# EAGLE design Wrinkles (EAGLE 6.4)
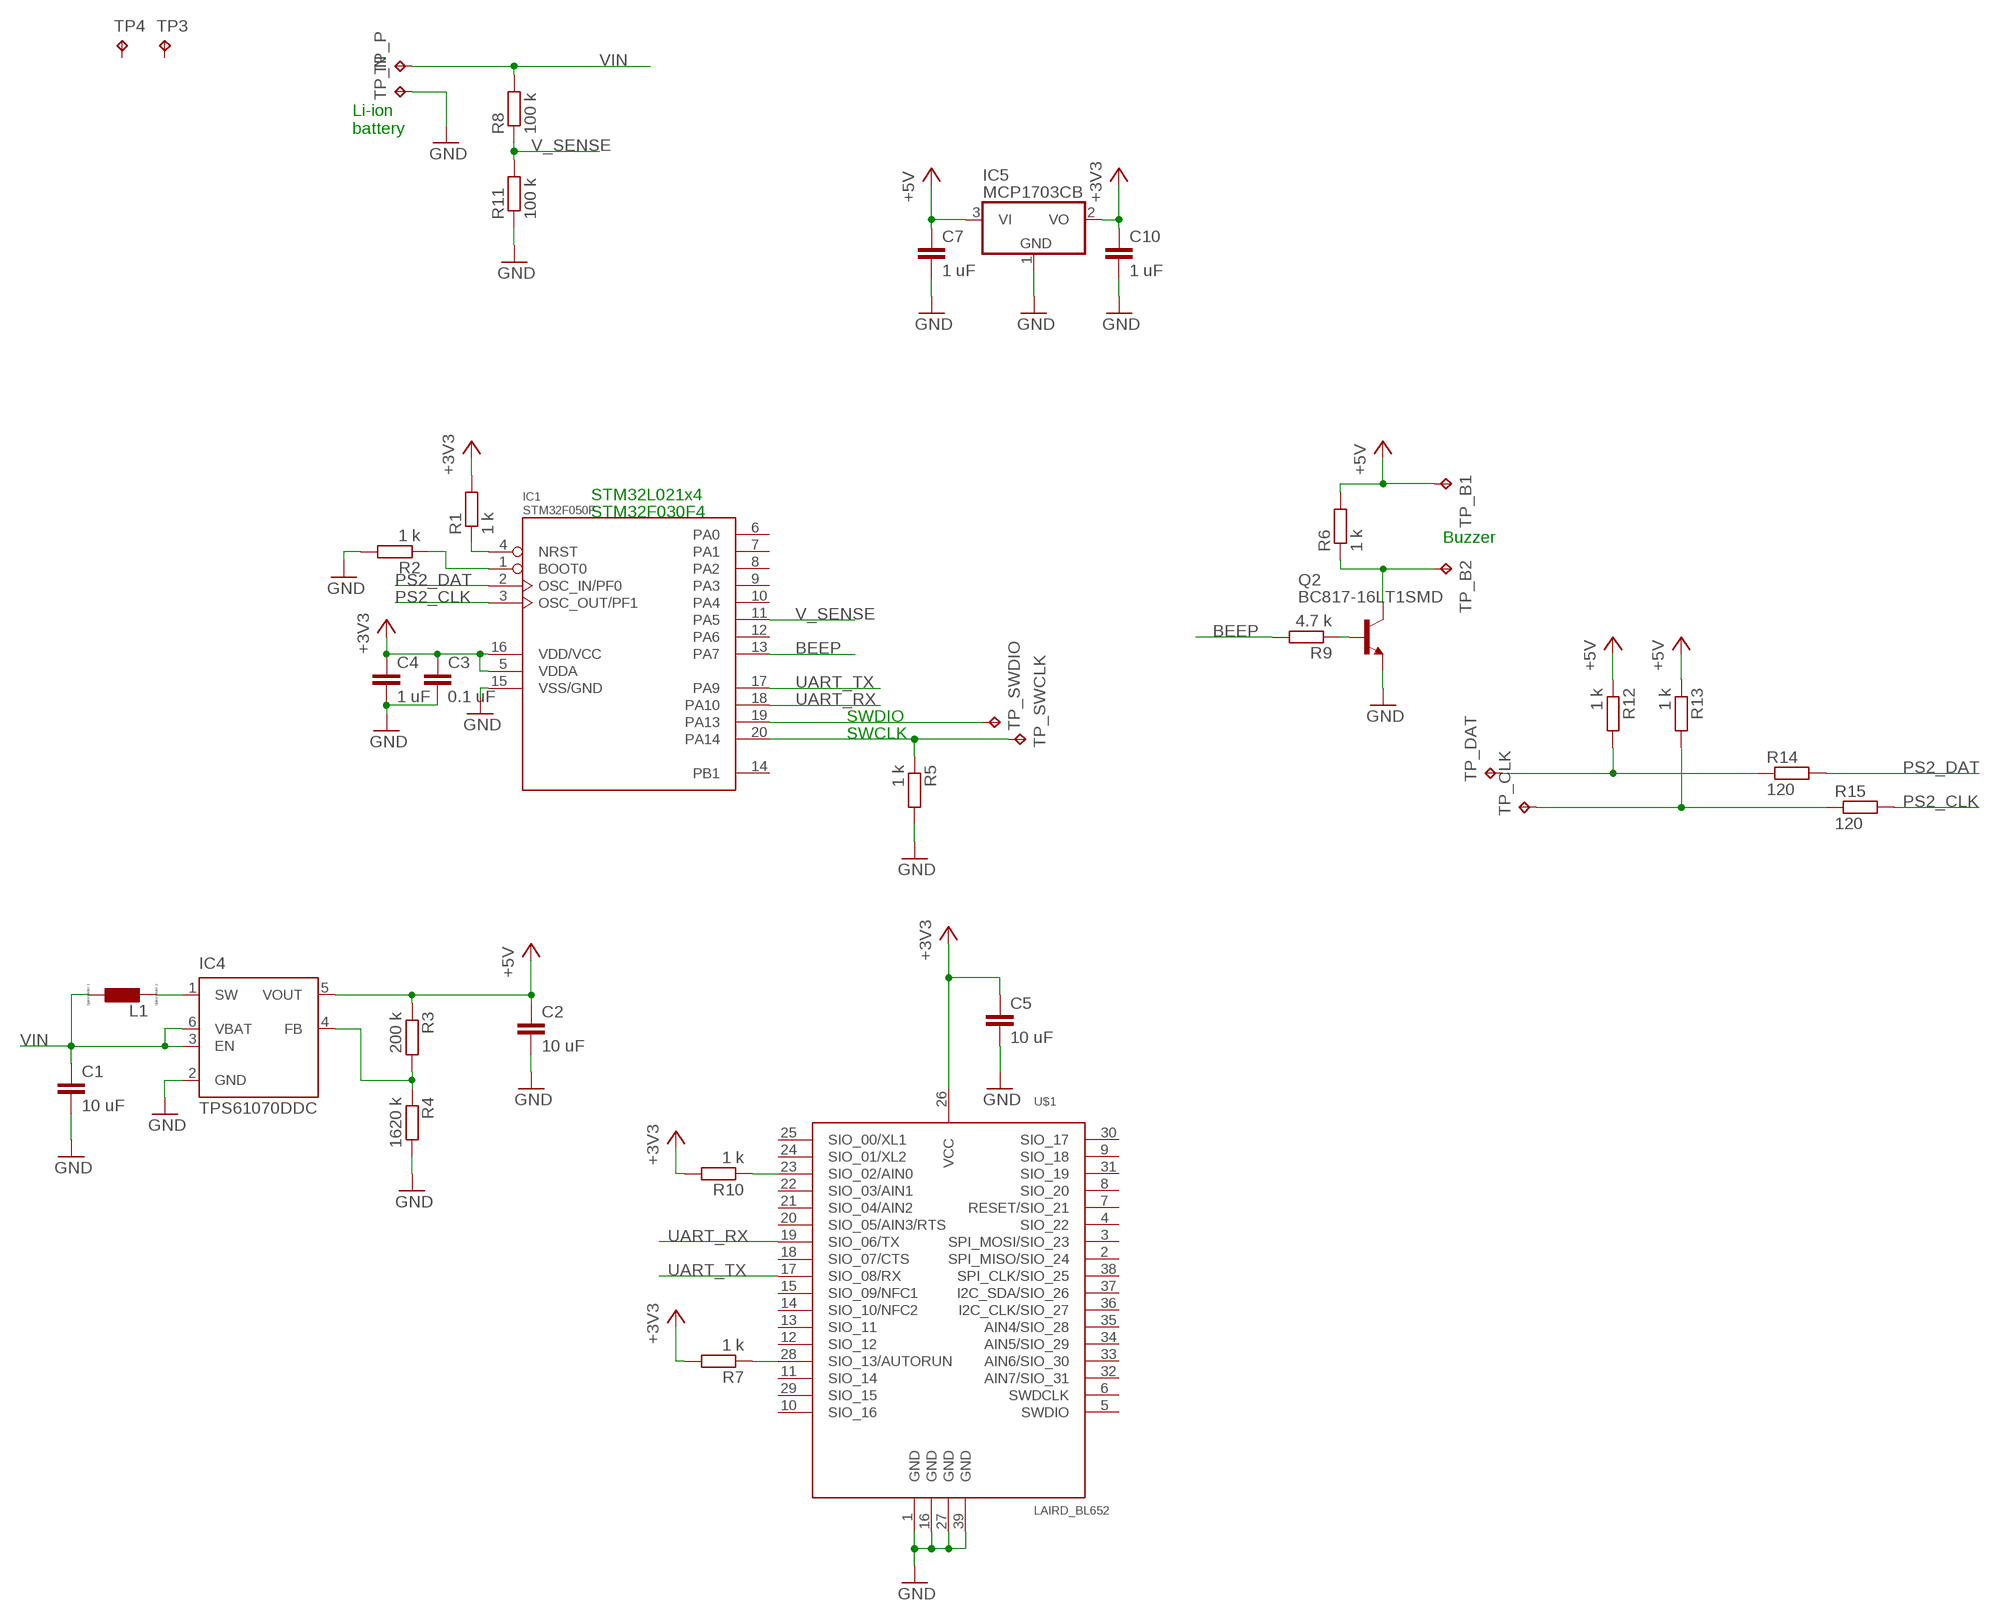
[diagram p0: schematic, sheet 1]

## Parts
C1  10 uF  C-EUC0603  [C0603]
C2  10 uF  C-EUC0603  [C0603]
C3  0.1 uF  C-EUC0402  [C0402]
C4  1 uF  C-EUC0402  [C0402]
C5  10 uF  C-EUC0603  [C0603]
C7  1 uF  C-EUC0402  [C0402]
C10  1 uF  C-EUC0402  [C0402]
IC1  STM32F050F  [TSSOP20]
IC4  TPS61070DDC  [TSOT23-6_DDC]
IC5  MCP1703CB  [SOT23]
L1  LL5038P  [L5038P]
Q2  BC817-16LT1SMD  [SOT23-BEC]
R1  1 k  R-EU_R0402  [R0402]
R2  1 k  R-EU_R0402  [R0402]
R3  200 k  R-EU_R0603  [R0603]
R4  1620 k  R-EU_R0603  [R0603]
R5  1 k  R-EU_R0402  [R0402]
R6  1 k  R-EU_R0402  [R0402]
R7  1 k  R-EU_R0402  [R0402]
R8  100 k  R-EU_R0402  [R0402]
R9  4.7 k  R-EU_R0402  [R0402]
R10  1 k  R-EU_R0402  [R0402]
R11  100 k  R-EU_R0402  [R0402]
R12  1 k  R-EU_R0402  [R0402]
R13  1 k  R-EU_R0402  [R0402]
R14  120  R-EU_R0402  [R0402]
R15  120  R-EU_R0402  [R0402]
TP3  TPPAD1-13  [P1-13]
TP4  TPPAD1-13  [P1-13]
TP_B1  TPPAD1-13  [P1-13]
TP_B2  TPPAD1-13  [P1-13]
TP_CLK  TPTP10SQ  [TP10SQ]
TP_DAT  TPTP10SQ  [TP10SQ]
TP_N  TPPAD1-13  [P1-13]
TP_P  TPPAD1-13  [P1-13]
TP_SWCLK  TPTP10SQ  [TP10SQ]
TP_SWDIO  TPTP10SQ  [TP10SQ]
U$1  LAIRD_BL652  [BL652]

## Nets
+3V3: C3.1 C4.1 C5.1 C10.1 IC1.5(VDDA) IC1.16(VDD/VCC) IC5.2(VO) R1.2 R7.2 R10.2 U$1.26(VCC)
+5V: C2.1 C7.1 IC4.5(VOUT) IC5.3(VI) R3.1 R6.2 R12.1 R13.1 TP_B1.TP
BEEP: IC1.13(PA7) R9.2
GND: C1.2 C2.2 C3.2 C4.2 C5.2 C7.2 C10.2 IC1.15(VSS/GND) IC4.2(GND) IC5.1(GND) Q2.E R2.2 R4.2 R5.2 R11.1 TP_N.TP U$1.1(GND) U$1.16(GND) U$1.27(GND) U$1.39(GND)
N$1: R7.1 U$1.28(SIO_13/AUTORUN)
N$2: R10.1 U$1.23(SIO_02/AIN0)
N$3: IC1.4(NRST) R1.1
N$4: IC1.1(BOOT0) R2.1
N$5: IC4.1(SW) L1.2
N$7: IC1.19(PA13) TP_SWDIO.TP
N$8: IC1.20(PA14) R5.1 TP_SWCLK.TP
N$9: R12.2 R14.1 TP_DAT.TP
N$10: R13.2 R15.1 TP_CLK.TP
N$13: IC4.4(FB) R3.2 R4.1
N$21: Q2.B R9.1
N$22: Q2.C R6.1 TP_B2.TP
PS2_CLK: IC1.3(OSC_OUT/PF1) R15.2
PS2_DAT: IC1.2(OSC_IN/PF0) R14.2
UART_RX: IC1.18(PA10) U$1.19(SIO_06/TX)
UART_TX: IC1.17(PA9) U$1.17(SIO_08/RX)
V_SENSE: IC1.11(PA5) R8.1 R11.2
VIN: C1.1 IC4.3(EN) IC4.6(VBAT) L1.1 R8.2 TP_P.TP
Unconnected: IC1.6(PA0) IC1.7(PA1) IC1.8(PA2) IC1.9(PA3) IC1.10(PA4) IC1.12(PA6) IC1.14(PB1) TP3.TP TP4.TP U$1.2(SPI_MISO/SIO_24) U$1.3(SPI_MOSI/SIO_23) U$1.4(SIO_22) U$1.5(SWDIO) U$1.6(SWDCLK) U$1.7(RESET/SIO_21) U$1.8(SIO_20) U$1.9(SIO_18) U$1.10(SIO_16) U$1.11(SIO_14) U$1.12(SIO_12) U$1.13(SIO_11) U$1.14(SIO_10/NFC2) U$1.15(SIO_09/NFC1) U$1.18(SIO_07/CTS) U$1.20(SIO_05/AIN3/RTS) U$1.21(SIO_04/AIN2) U$1.22(SIO_03/AIN1) U$1.24(SIO_01/XL2) U$1.25(SIO_00/XL1) U$1.29(SIO_15) U$1.30(SIO_17) U$1.31(SIO_19) U$1.32(AIN7/SIO_31) U$1.33(AIN6/SIO_30) U$1.34(AIN5/SIO_29) U$1.35(AIN4/SIO_28) U$1.36(I2C_CLK/SIO_27) U$1.37(I2C_SDA/SIO_26) U$1.38(SPI_CLK/SIO_25)

## Notes on the sheet
- Li-ion 
  battery
- STM32L021x4
- STM32F030F4
- Buzzer
- SWDIO
- SWCLK

## Library data of the parts
C1-C5 C7 C10 = rcl:C-EU: CAPACITOR, European symbol
IC1 = stm32 - Copy:STM32F050*: STM32F050xxF*
IC4 = texas:TPS6107*: 90% EFFICIENT SYNCHRONOUS BOOST CONVERTER WITH 600-mA SWITCH Source: http://focus.ti.com/lit/ds/symlink/tps61070.pdf; MPN: TPS61070DDCR; OC_FARNELL: 1461062; OC_NEWARK: 64M3125
IC5 = linear:MCP1703: 250 mA, 16V, Low Quiescent Current LDO Regulator Source: http://ww1.microchip.com/downloads/en/DeviceDoc/22049b.pdf
L1 = eagle-ltspice:L: INDUCTOR, European symbol; SPICEMODEL: NONE; SPICEPREFIX: L
Q2 = transistor-npn:BC817*: NPN Transistor
R1-R15 = resistor:R-EU_: RESISTOR, European symbol
TP3 TP4 TP_B1 TP_B2 TP_CLK TP_DAT TP_N TP_P TP_SWCLK TP_SWDIO = testpad:TP: Test pad
U$1 = ewheel32:LAIRD_BL652: Bluetooth Low Energy Module

## Board
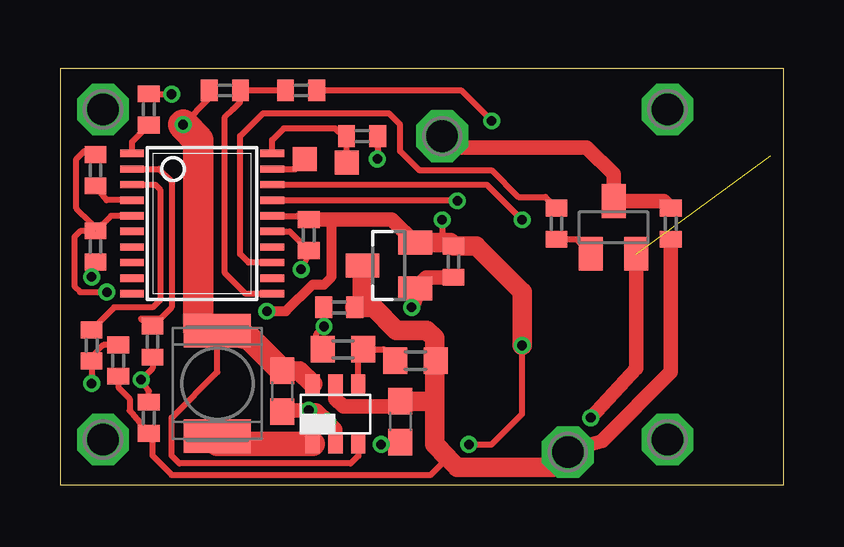
[diagram p1: board, top side]
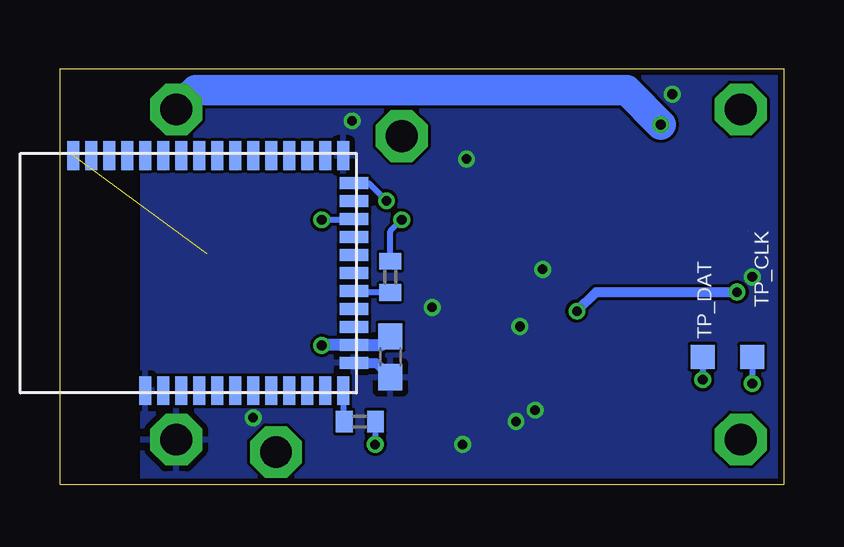
[diagram p2: board, bottom side, seen from below]

Size 30.16 x 17.36 mm. Coordinates in mm from the lower left corner, seen from the top.
Outline: 0,0 30.16,0 30.16,17.36 0,17.36 0,0
Copper layers (1*16): Top 0.035mm / dielectric 1.5mm / Bottom 0.035mm
Design rules "dirt_cheap_dirty_boards.v1": minimum track width 5mil, minimum drill 12mil, track to track 5mil, track to pad 5mil, pad to pad 5mil, via to via 5mil, smd to smd 0mil, copper to edge 10mil, drill to drill 10mil, minimum pad ring 10mil, minimum via ring 6mil, stop-mask expansion 2mil, vias tented up to drill 25mil, thermal gap 10mil

### Footprints (pad centres in the part's own frame; a part is rotated, then mirrored left to right if it is on the bottom)
C0603 = smd 1.1 x 1: 1 -0.85,0; 2 0.85,0
C0402 = smd 0.7 x 0.9: 1 -0.65,0; 2 0.65,0
TSSOP20 = smd 0.305 x 0.991: 1 -2.925,-2.918; 2 -2.275,-2.918; 3 -1.625,-2.918; 4 -0.975,-2.918; 5 -0.325,-2.918; 6 0.325,-2.918; 7 0.975,-2.918; 8 1.625,-2.918; 9 2.275,-2.918; 10 2.925,-2.918; 11 2.925,2.918; 12 2.275,2.918; 13 1.625,2.918; 14 0.975,2.918; 15 0.325,2.918; 16 -0.325,2.918; 17 -0.975,2.918; 18 -1.625,2.918; 19 -2.275,2.918; 20 -2.925,2.918
TSOT23-6_DDC = smd 0.6 x 0.8: 1 -0.95,-1.25; 2 0,-1.25; 3 0.95,-1.25; 4 0.95,1.25; 5 0,1.25; 6 -0.95,1.25
SOT23 = smd 1 x 1.4: 1 -0.95,-1.1; 2 0.95,-1.1; 3 0,1.1
L5038P = smd 1.4 x 2.8: 1 -2.2,0; 2 2.2,0
SOT23-BEC = smd 1 x 1.4: B -0.95,-1.1; C 0,1.1; E 0.95,-1.1
R0402 = smd 0.7 x 0.9: 1 -0.65,0; 2 0.65,0
R0603 = smd 1 x 1.1: 1 -0.85,0; 2 0.85,0
P1-13 = drill 1.321 pad 2.159 octagon: TP 0,0
TP10SQ = smd 1 x 1: TP 0,0
BL652 = smd 1.2 x 0.5: 1 4.9,4.8; 2 4.9,4.05; 3 4.9,3.3; 4 4.9,2.55; 5 4.9,1.8; 6 4.9,1.05; 7 4.9,0.3; 8 4.9,-0.45; 9 4.9,-1.2; 10 4.9,-1.95; 11 4.9,-2.7; 12 4.9,-3.45; 13 4.9,-4.2; 14 4.9,-4.95; 15 4.9,-5.7; 16 4.9,-6.45; 28 -4.9,-6.45; 29 -4.9,-5.7; 30 -4.9,-4.95; 31 -4.9,-4.2; 32 -4.9,-3.45; 33 -4.9,-2.7; 34 -4.9,-1.95; 35 -4.9,-1.2; 36 -4.9,-0.45; 37 -4.9,0.3; 38 -4.9,1.05; 39 -4.9,1.8 | smd 0.5 x 1.2: 17 3.75,-6.9; 18 3,-6.9; 19 2.25,-6.9; 20 1.5,-6.9; 21 0.75,-6.9; 22 0,-6.9; 23 -0.75,-6.9; 24 -1.5,-6.9; 25 -2.25,-6.9; 26 -3,-6.9; 27 -3.75,-6.9

### Placement (x,y rotation side)
C1  9.26,3.91 270 top
C2  14.18,2.64 270 top
C3  1.48,9.94 270 top
C4  10.37,10.41 270 top
C5  16.4,5.33 270 bottom
C7  11.64,7.4 180 top
C10  16.4,9.3 270 top
IC1  5.92,10.89 270 top
IC4  11.48,2.95 0 top
IC5  13.7,9.14 90 top
L1  6.56,4.22 270 top
Q2  23.07,10.73 0 top
R1  1.48,13.11 90 top
R2  3.7,15.65 90 top
R3  14.81,5.18 180 top
R4  11.8,5.65 180 top
R5  12.59,14.54 0 top
R6  25.45,10.89 270 top
R7  17.67,2.64 0 bottom
R8  6.87,16.45 180 top
R9  20.69,10.89 90 top
R10  16.4,8.67 90 bottom
R11  10.05,16.45 180 top
R12  3.7,2.79 90 top
R13  2.43,5.18 90 top
R14  3.86,5.97 90 top
R15  1.32,5.81 90 top
TP3  1.79,15.65 0 top
TP4  1.79,1.88 0 top
TP_B1  21.16,1.37 0 top
TP_B2  15.92,14.54 0 top
TP_CLK  1.32,5.33 0 bottom
TP_DAT  3.38,5.33 0 bottom
TP_N  25.31,1.88 0 top
TP_P  25.31,15.65 0 top
TP_SWCLK  11.95,13.43 90 top
TP_SWDIO  10.21,13.59 90 top
U$1  24.81,8.83 90 bottom

### Tracks (layer width: path | path; a pad name or v marks a point on that pad's centre or on a via)
+3V3  (via drill 0.4)  (1 unrouted)
  Top 0.254: IC1.16 9.87,11.21 C4.1 | C3.1 1.3,10.91 0.68,11.52 0.68,13.59 1,13.91 1.46,13.91 R1.2 | v17.03,1.68 17.99,1.68 19.26,2.95 v19.26,5.81 | v15.92,11.05 15.92,10.09 | IC1.5 2.12,11.21 1.48,10.57 0.84,10.57 0.6,10.33 0.6,8.27 0.84,8.03 v1.95,8.03
  Top 0.406: v8.62,7.24 9.41,7.24 10.53,8.35 11,8.35 11.32,8.67 11.32,11.06
  Top 0.61: C4.1 11.32,11.06 13.83,11.06 IC5.2 | 16.26,10.09 C10.1
  Top 0.813: IC5.2 15.92,10.09 16.26,10.09 | C10.1 17.34,9.95 19.26,8.03 v19.26,5.81
  Bottom 0.254: R7.2 17.02,1.7 v17.03,1.68 | R10.2 16.4,10.57 v15.92,11.05
  Bottom 0.406: v1.95,8.03 7.83,8.03 v8.62,7.24
  Bottom 0.5: 19.24,5.83 U$1.26 16.76,5.83 C5.1
  Bottom 0.61: 19.24,5.83 v19.26,5.81
+5V
  Top 0.254: 15.29,4.8 15.61,5.12 | R13.1 2.43,4.06 2.91,3.59 2.91,3.1 R12.1 3.86,2.14 3.86,1.21 4.65,0.41 15.45,0.41 16.16,1.13
  Top 0.61: IC4.5 11.48,3.59 11.79,3.27 13.96,3.27 C2.1 | R6.2 25.45,4.7 22.59,1.84 TP_B1.TP
  Top 0.813: 15.61,3.43 15.61,1.68 16.16,1.13 16.56,0.73 20.53,0.73 TP_B1.TP | 15.61,3.43 15.61,5.12 R3.1 15.61,5.23 15.61,6.13 15.29,6.45 14.02,6.45 13.07,7.4 C7.1 12.6,7.71 IC5.3 | C2.1 15.55,3.48 15.61,3.43
BEEP
  Top 0.254: IC1.13 7.86,9.26 7.51,9.62 7.51,14.54 8.46,15.49 13.7,15.49 14.18,15.02 14.18,13.91 14.97,13.11 17.99,13.11 19.1,12 20.22,12 R9.2 20.68,11.52
GND  (via drill 0.4)  (1 unrouted)
  Top 0.254: R4.2 10.68,5.65 10.68,6.29 v11,6.6 C7.2 | C3.2 1.46,8.65 v1.32,8.67 | v10.05,8.98 10.38,9.63 C4.2 9.56,10.56 IC1.15 | R5.2 13.24,14.08 v13.22,13.59 | v4.65,16.29 4.17,16.29 R2.2 | C2.2 13.49,1.79 v13.38,1.68 | R11.1 16.72,16.45 v17.99,15.18
  Top 0.61: IC4.2 11.48,2.32 v11.16,2.63 10.68,3.11 9.26,3.11 C1.2 | C10.2 15.26,8.65 IC5.1 14.8,7.7 v14.65,7.4 | Q2.E 24.02,4.86 v22.11,2.79
  Bottom 0.406: U$1.27 16.99,5.08 C5.2
  other vias: 10.37,3.11
  pour Bottom: 0.21,17.24 26.72,17.24 26.72,0.1 0.21,0.1
N$1
  Bottom 0.254: U$1.28 18.36,2.68 R7.1
N$2
  Bottom 0.254: R10.1 17.85,8.02 U$1.23
N$3
  Top 0.254: IC1.4 1.95,11.86 R1.1
N$4
  Top 0.254: IC1.1 3,14.31 R2.1
N$5
  Top 1.016: IC4.1 6.56,1.7 L1.2
N$7
  Top 0.254: IC1.19 9.84,13.17 TP_SWDIO.TP
N$8
  Top 0.254: TP_SWCLK.TP 11.95,14.53 R5.1 11.79,14.54 11.48,14.86 9.32,14.86 8.84,14.38 IC1.20
N$9  (via drill 0.4)
  Top 0.254: R14.1 3.86,4.86 v3.38,4.38 3.7,3.9 R12.2
  Bottom 0.254: TP_DAT.TP v3.38,4.38
N$10  (via drill 0.4)
  Top 0.254: R13.2 1.81,5.82 TP_CLK.TP R15.1 v1.32,4.22
  Bottom 0.254: TP_CLK.TP v1.32,4.22
N$13
  Top 0.254: R3.2 13.49,5.65 R4.1 12.43,5.43 IC4.4
N$21
  Top 0.254: R9.1 21.51,10.24 Q2.B
N$22
  Top 0.61: R6.1 25.16,11.83 Q2.C 23.07,12.95 21.96,14.07 16.72,14.07 16.24,14.54 TP_B2.TP
PS2_CLK
  Top 0.254: IC1.3 3.98,12.51 4.17,12.32 4.17,7.71 3.86,7.4 2.25,7.4 R15.2
PS2_DAT
  Top 0.254: IC1.2 4.12,13.17 4.65,12.64 4.65,7.4 4.17,6.92 3.37,6.92 R14.2
UART_RX  (via drill 0.4)
  Top 0.254: IC1.18 17.79,12.51 v19.26,11.05
  Bottom 0.254: U$1.19 17.99,11.05 v19.26,11.05
UART_TX  (via drill 0.4)
  Top 0.254: IC1.17 16.22,11.86 v16.56,11.84
  Bottom 0.254: U$1.17 17.29,12.58 v16.56,11.84
V_SENSE
  Top 0.254: R11.2 R8.1 7.51,15.95 7.19,15.65 6.87,15.33 6.87,8.83 7.73,7.96 IC1.11
VIN  (via drill 0.4)
  Top 0.254: R8.2 6.22,16.11 v5.13,15.02 | IC4.3 12.43,1.2 12.11,0.89 4.97,0.89 4.65,1.21 4.65,2.79 6.56,4.7 L1.1
  Top 0.813: C1.1 9.97,4.75 IC4.6
  Top 1.016: L1.1 7.9,6.11 C1.1
  Top 1.27: 5.76,6.45 5.92,6.45 L1.1 5.76,6.6 5.76,14.38 v5.13,15.02
  Bottom 1.27: TP_P.TP 25.29,15.65 24.5,16.45 6.56,16.45 v5.13,15.02